# Altium project eps.PrjPCB (part 2 of 2)

## Sheet boost.SchDoc: Boost
size A; DrawnBy: J. Reimer T. Yeung M. Hirole; Organization: UTAT SS; DocumentNumber: 3; Revision: 2.0; SheetNumber: 3; SheetTotal: 17
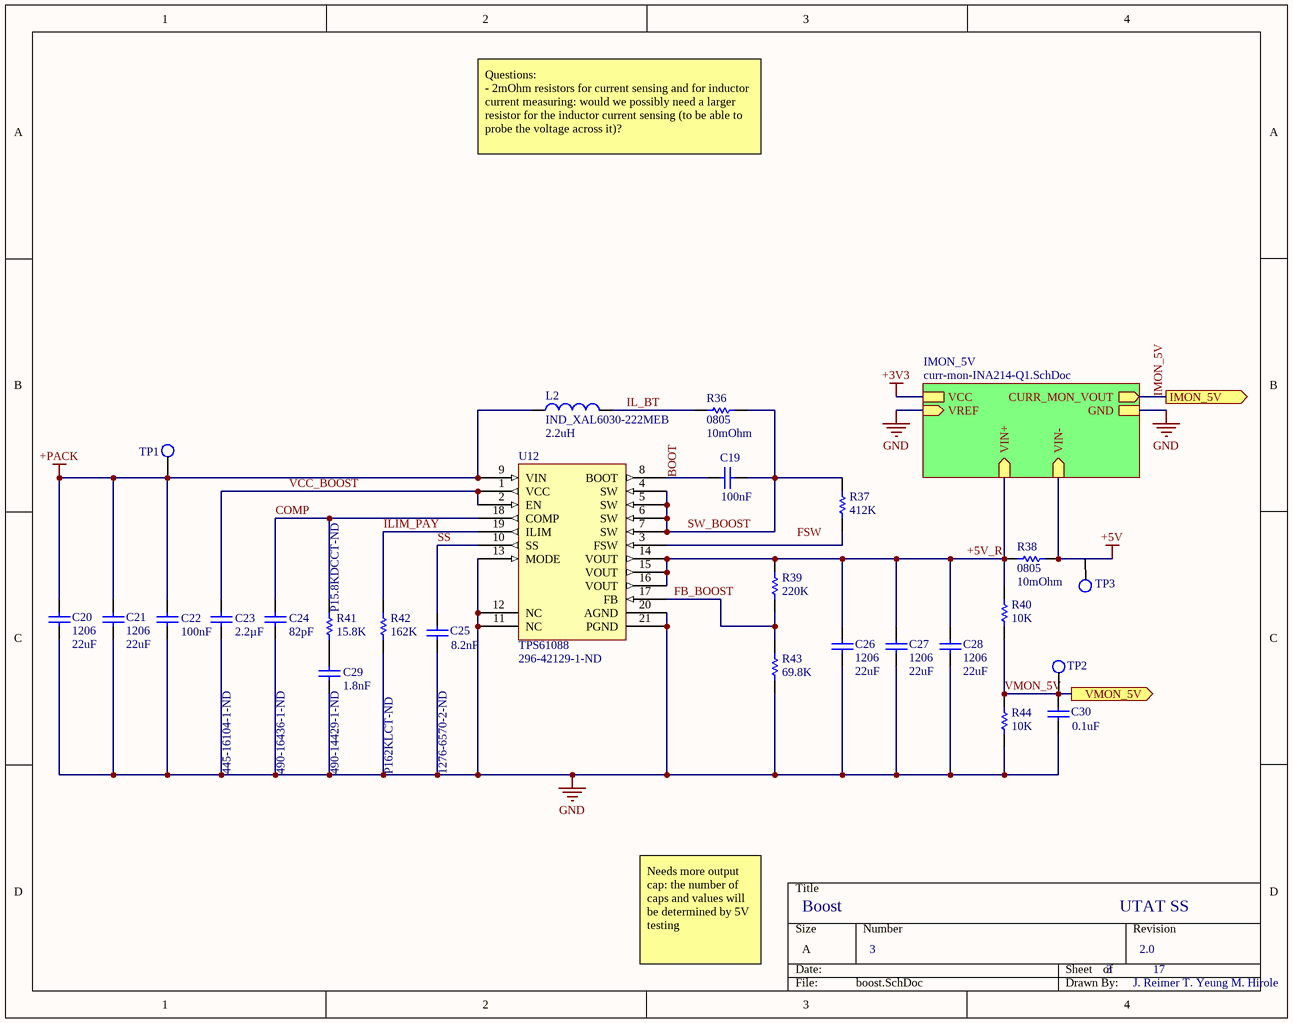
[diagram p9: boost.SchDoc]

### Parts
C19  value 100nF  [CAP0402R]  (hidden comment: 0402)
C20  1206  value 22uF  [CAP1206R]
C21  1206  value 22uF  [CAP1206R]
C22  value 100nF  [CAP0402R]  (hidden comment: 0402)
C23  value 2.2µF  Supplier Part Number 1: 445-16104-1-ND  [CAP0603R]  (hidden comment: 0603)
C24  value 82pF  Supplier Part Number 1: 490-16436-1-ND  [CAP0402R]  (hidden comment: 0402)
C25  value 8.2nF  Supplier Part Number 1: 1276-6570-2-ND  [CAP0402R]  (hidden comment: 0402)
C26  1206  value 22uF  [CAP1206R]
C27  1206  value 22uF  [CAP1206R]
C28  1206  value 22uF  [CAP1206R]
C29  value 1.8nF  Supplier Part Number 1: 490-14429-1-ND  [CAP0402R]  (hidden comment: 0402)
C30  value 0.1uF  [CAP0402R]  (hidden comment: 0402)
L2  IND_XAL6030-222MEB  value 2.2uH  [XAL6030-222MEB]
R36  0805  value 10mOhm  [RES0805R]
R37  value 412K  [RES0402R]  (hidden comment: 0402)
R38  0805  value 10mOhm  [RES0805R]
R39  value 220K  [RES0402R]  (hidden comment: 0402)
R40  value 10K  [RES0402R]  (hidden comment: 0402)
R41  value 15.8K  Supplier Part Number 1: P15.8KDCCT-ND  [RES0402R]  (hidden comment: 0402)
R42  value 162K  Supplier Part Number 1: P162KLCT-ND  [RES0402R]  (hidden comment: 0402)
R43  value 69.8K  [RES0402R]  (hidden comment: 0402)
R44  value 10K  [RES0402R]  (hidden comment: 0402)
U12  TPS61088  Supplier Part Number 1: 296-42129-1-ND  [QFN50P450X350X100-21N]

### Sub-sheets
IMON_5V = curr-mon-INA214-Q1.SchDoc (file not in this document): VREF (in), VIN+ (in), VCC, GND, VIN- (in), CURR_MON_VOUT (out)

### Ports
IMON_5V (out), VMON_5V (out)

### Nets
+5V: R38.2 ; sheet IMON_5V/VIN-
+PACK: C20.2 C21.2 C22.2 L2.1 U12.9(VIN)
GND: C20.1 C21.1 C22.1 C23.1 C24.1 C25.1 C26.1 C27.1 C28.1 C29.1 C30.2 R42.1 R43.1 R44.1 U12.11(NC) U12.12(NC) U12.13(MODE) U12.20(AGND) U12.21(PGND) ; sheet IMON_5V/VREF, sheet IMON_5V/GND
+5V_R: C26.2 C27.2 C28.2 R38.1 R39.2 R40.2 U12.14(VOUT) U12.15(VOUT) U12.16(VOUT) ; sheet IMON_5V/VIN+
BOOT: C19.2 U12.8(BOOT)
COMP: C24.2 R41.2 U12.18(COMP)
FB_BOOST: R39.1 R43.2 U12.17(FB)
IL_BT: L2.2 R36.1
ILIM_PAY: R42.2 U12.19(ILIM)
IMON_5V: port IMON_5V, sheet IMON_5V/CURR_MON_VOUT
SS: C25.2 U12.10(SS)
SW_BOOST: C19.1 R36.2 R37.1 U12.4(SW) U12.5(SW) U12.6(SW) U12.7(SW)
VCC_BOOST: C23.2 U12.1(VCC) U12.2(EN)
VMON_5V: C30.1 R40.1 R44.2 ; port VMON_5V
NetC29_2: C29.2 R41.1
NetR37_2: R37.2 U12.3(FSW)

### Notes on the sheet
- Questions:
  - 2mOhm resistors for current sensing and for inductor current measuring: would we possibly need a larger resistor for the inductor current sensing (to be able to probe the voltage across it)?
- TP1
- (near R38) TP3
- (near C30) TP2
- Needs more output cap: the number of caps and values will be determined by 5V testing
- Labels drawn without touching a wire or pin: FSW

### Library data of the parts
C19 C22 C30 = CAP0402: 0402 capacitor
C20 C21 C26-C28 = CAP1206: 1206 capacitor
C23 = CAP0603: 0603 capacitor; Manufacturer: TDK; Manufacturer Part Number: CGA3E1X7S1C225K080AC; Capacitance: 2.2uF; Tolerance: 10%; Voltage Rating: 16V; Dielectric: X7S; Supplier 1: Digi-Key; Stock 1: 772454; Pricing 1: 1=0.3, 10=0.203, 100=0.115, 500=0.08114, 1000=0.071 (USD); Mount: Surface Mount; Case/Package: 0603; Case Code (Metric): 1608; Case Code (Imperial): 0603; Min Operating Temperature: -55°C; Max Operating Temperature: 125°C; Package Quantity: 1; Packaging: Cut Tape; Voltage Rating (DC): 16V; Length: 0.063inch; Width: 0.031inch; Thickness: 0.035inch; Ratings: AEC-Q200; REACH SVHC: No SVHC; Lead Free: Lead Free; ComponentLink1URL: https://product.tdk.com/info/en/catalog/spec/mlccspec_automotive_general_midvoltage_en.pdf?src-supplier=Digi-Key; ComponentLink1Description: https://product.tdk.com/info/en/catalog/spec/mlccspec_automotive_general_midvoltage_en.pdf?src-supplier=Digi-Key; ComponentLink2URL: http://www.farnell.com/datasheets/1936565.pdf?src-supplier=Element14; ComponentLink2Description: http://www.farnell.com/datasheets/1936565.pdf?src-supplier=Element14; ComponentLink3URL: https://product.tdk.com/info/en/catalog/datasheets/mlcc_automotive_general_en.pdf?src-supplier=Digi-Key; ComponentLink3Description: https://product.tdk.com/info/en/catalog/datasheets/mlcc_automotive_general_en.pdf?src-supplier=Digi-Key; ComponentLink4URL: http://product.tdk.com/en/catalog/datasheets/mlcc_automotive_general_en.pdf?src-supplier=Avnet; ComponentLink4Description: http://product.tdk.com/en/catalog/datasheets/mlcc_automotive_general_en.pdf?src-supplier=Avnet; ComponentLink5URL: http://www.farnell.com/datasheets/2292075.pdf?src-supplier=Farnell; ComponentLink5Description: http://www.farnell.com/datasheets/2292075.pdf?src-supplier=Farnell; ComponentLink6URL: http://www.farnell.com/datasheets/1936565.pdf?src-supplier=Farnell; ComponentLink6Description: http://www.farnell.com/datasheets/1936565.pdf?src-supplier=Farnell
C24 = CAP0402: 0402 capacitor; Manufacturer: Murata; Manufacturer Part Number: GCM1555C1H820FA16D; Tolerance: 1%; Voltage Rating: 50V; Supplier 1: Digi-Key; Stock 1: 58762; Pricing 1: 1=0.13, 10=0.09, 100=0.0424, 500=0.0297, 1000=0.02459, 2500=0.02289, 5000=0.02094 (USD); Mount: Surface Mount; Case/Package: 0402; Case Code (Imperial): 0402; Case Code (Metric): 1005; Min Operating Temperature: -55°C; Max Operating Temperature: 125°C; Packaging: Tape and Reel; Capacitance: 82pF; Ratings: AEC-Q200; ComponentLink1URL: http://search.murata.co.jp/Ceramy/image/img/A01X/G101/ENG/GCM1555C1H820FA16-01.pdf?src-supplier=Digi-Key; ComponentLink1Description: http://search.murata.co.jp/Ceramy/image/img/A01X/G101/ENG/GCM1555C1H820FA16-01.pdf?src-supplier=Digi-Key
C25 = CAP0402: 0402 capacitor; Manufacturer: Samsung; Manufacturer Part Number: CL05B822KB5VPNC; Voltage Rating: 50V; Tolerance: 10%; Supplier 1: Digi-Key; Stock 1: 10000; Pricing 1: 10000=0.00495 (USD); Mount: Surface Mount; Case/Package: 0402; Case Code (Metric): 1005; Case Code (Imperial): 0402; Min Operating Temperature: -55°C; Max Operating Temperature: 125°C; Packaging: Tape and Reel; Capacitance: 8.2nF; Features: Soft Termination; Length: 0.039inch; Width: 0.02inch; Thickness: 0.022inch; Ratings: AEC-Q200
C29 = CAP0402: 0402 capacitor; Manufacturer: Murata; Manufacturer Part Number: GCM155R71H182KA37D; Tolerance: 10%; Voltage Rating: 50V; Supplier 1: Digi-Key; Stock 1: 73085; Pricing 1: 1=0.1, 10=0.032, 100=0.0143, 500=0.01022, 1000=0.00803, 2500=0.0073, 5000=0.00671 (USD); Mount: Surface Mount; Case/Package: 0402; Case Code (Imperial): 0402; Case Code (Metric): 1005; Min Operating Temperature: -55°C; Max Operating Temperature: 125°C; Packaging: Cut Tape; Capacitance: 1.8nF; Ratings: AEC-Q200; ComponentLink1URL: http://search.murata.co.jp/Ceramy/image/img/A01X/partnumbering_e_02.pdf?src-supplier=Digi-Key; ComponentLink1Description: http://search.murata.co.jp/Ceramy/image/img/A01X/partnumbering_e_02.pdf?src-supplier=Digi-Key; ComponentLink2URL: http://search.murata.co.jp/Ceramy/image/img/A01X/G101/ENG/GCM155R71H182KA37-01.pdf?src-supplier=Digi-Key; ComponentLink2Description: http://search.murata.co.jp/Ceramy/image/img/A01X/G101/ENG/GCM155R71H182KA37-01.pdf?src-supplier=Digi-Key
L2 = IND_XAL6030-222MEB: Inductor; Manufacturer: Coilcraft; Code_IEC: 1005; Core Material: Composite; Tolerance: 20%; Self Resonant Frequency: 30MHz; Shielding: Shielded; Max DC Current: 10A; DC Resistance (DCR): 13.97mR; Test Frequency: 100kHz; Published: 8-Jun-2000; LatestRevisionDate: 29-May-2009; LatestRevisionNote: IPC-7351 Footprint Added.; PackageReference: 0402-A; Publisher: Altium Limited; PackageDescription: Chip Inductor; Code_JEITA: 0402; ComponentLink1Description: Supplier Link; ComponentLink1URL: https://www.mouser.ca/ProductDetail/Coilcraft/XAL6030-222MEB?qs=sGAEpiMZZMsg%252By3WlYCkU2kWFds1hA9DXj9xdKzQVV4%3D; Supplier 1: Mouser; Manufacturer Part Number: XAL6030-222MEB; Stock 1: 3253; Pricing 1: 1=1.85, 10=1.85, 50=1.85, 100=1.7, 400=1.28, 800=0.942, 1000=0.942, 2000=0.877, 10000=0.877 (USD); Min Operating Temperature: -40°C; Max Operating Temperature: 125°C; Packaging: Tape and Reel; Package Quantity: 20; Inductance: 2.2uH; Termination: SMD/SMT; Length: 6.76mm; Height: 3.1mm; Width: 6.56mm; Lead Free: Contains Lead; Supplier Part Number 1: 994-XAL6030-222MEB
R36 R38 = RES0805: 0805 resistor; Manufacturer: Panasonic; Manufacturer Part Number: ERJ-8BWJR010V; Resistance: 10mR; Power Rating: 1W; Tolerance: 5%; Temperature Coefficient: 200ppm/°C; Supplier 1: Digi-Key; Supplier Part Number 1: P.010AVDKR-ND; Stock 1: 70650; Pricing 1: 1=0.68, 10=0.5, 100=0.2911, 1000=0.16327, 2500=0.15763 (USD); Mount: Surface Mount; Case/Package: 1206; Case Code (Imperial): 1206; Case Code (Metric): 3216; Contact Plating: Tin; Min Operating Temperature: -55°C; Max Operating Temperature: 155°C; Packaging: Tape and Reel; Package Quantity: 1; Termination: SMD/SMT; Composition: Thick Film; Number of Terminations: 2; Military Standard: Not; Max Power Dissipation: 1W; Features: Automotive AEC-Q200; Length: 3.2mm; Height: 0.65mm; Width: 1.6mm; Depth: 1.6mm; Radiation Hardening: No; Lead Free: Lead Free; ComponentLink1URL: http://industrial.panasonic.com/www-data/pdf/AOA0000/AOA0000CE3.pdf?src-supplier=Avnet; ComponentLink1Description: http://industrial.panasonic.com/www-data/pdf/AOA0000/AOA0000CE3.pdf?src-supplier=Avnet; ComponentLink2URL: https://industrial.panasonic.com/cdbs/www-data/pdf/RDN0000/AOA0000C313.pdf?src-supplier=Digi-Key; ComponentLink2Description: https://industrial.panasonic.com/cdbs/www-data/pdf/RDN0000/AOA0000C313.pdf?src-supplier=Digi-Key; ComponentLink3URL: http://uk.rs-online.com/webdocs/13b8/0900766b813b869e.pdf?src-supplier=RSComponents; ComponentLink3Description: http://uk.rs-online.com/webdocs/13b8/0900766b813b869e.pdf?src-supplier=RSComponents
R37 R39 R40 R43 R44 = RES0402: 0402 resistor
R41 = RES0402: 0402 resistor; Manufacturer: Panasonic; Manufacturer Part Number: ERA-2AEB1582X; Resistance: 15.8kR; Power Rating: 63mW; Tolerance: 0.1%; Voltage Rating: 25V; Temperature Coefficient: 25ppm/°C; Voltage Rating (DC): 50V; Supplier 1: Digi-Key; Stock 1: 20576; Pricing 1: 1=0.45, 10=0.321, 100=0.1283, 1000=0.06322, 2500=0.05858, 5000=0.053 (USD); Mount: Surface Mount; Case/Package: 0402; Case Code (Metric): 1005; Case Code (Imperial): 0402; Contact Plating: Tin; Min Operating Temperature: -55°C; Max Operating Temperature: 155°C; Packaging: Tape and Reel; Package Quantity: 10000; Composition: Thin Film,Metal Film; Number of Terminations: 2; Max Power Dissipation: 63mW; Termination: SMD/SMT; Length: 0.039inch; Height: 0.016inch; Width: 0.02inch; Radiation Hardening: No; REACH SVHC: Unknown; Lead Free: Lead Free; ComponentLink1URL: http://industrial.panasonic.com/www-data/pdf/AOA0000/AOA0000CE26.pdf?src-supplier=Avnet; ComponentLink1Description: http://industrial.panasonic.com/www-data/pdf/AOA0000/AOA0000CE26.pdf?src-supplier=Avnet
R42 = RES0402: 0402 resistor; Manufacturer: Panasonic; Manufacturer Part Number: ERJ-2RKF1623X; Resistance: 162kR; Power Rating: 100mW; Tolerance: 1%; Voltage Rating: 50V; Temperature Coefficient: 100ppm/°C; Supplier 1: Digi-Key; Stock 1: 0; Mount: Surface Mount; Case/Package: 0402; Weight: 2.8E-05oz; Case Code (Imperial): 0402; Case Code (Metric): 1005; Contact Plating: Tin; Min Operating Temperature: -55°C; Max Operating Temperature: 155°C; Packaging: Tape and Reel; Package Quantity: 10000; Composition: Thick Film; Termination: SMD/SMT; Number of Terminations: 2; Military Standard: Not; Max Power Dissipation: 100mW; Voltage Rating (DC): 50V; Features: Automotive AEC-Q200; Length: 1mm; Height: 0.35mm; Width: 0.5mm; Depth: 0.5mm; Radiation Hardening: No; REACH SVHC: Yes; Lead Free: Lead Free; ComponentLink1URL: http://www.farnell.com/datasheets/1678782.pdf?src-supplier=Element14; ComponentLink1Description: http://www.farnell.com/datasheets/1678782.pdf?src-supplier=Element14; ComponentLink2URL: http://www.farnell.com/datasheets/1678782.pdf?src-supplier=Farnell; ComponentLink2Description: http://www.farnell.com/datasheets/1678782.pdf?src-supplier=Farnell; ComponentLink3URL: https://www.alliedelec.com/m/d/623f45ff1957d936ff56d46fd1c28cac.pdf?src-supplier=Allied+Electronics; ComponentLink3Description: https://www.alliedelec.com/m/d/623f45ff1957d936ff56d46fd1c28cac.pdf?src-supplier=Allied+Electronics; ComponentLink4URL: http://www.farnell.com/datasheets/1911175.pdf?src-supplier=Farnell; ComponentLink4Description: http://www.farnell.com/datasheets/1911175.pdf?src-supplier=Farnell; ComponentLink5URL: http://www.farnell.com/datasheets/1694929.pdf?src-supplier=Element14; ComponentLink5Description: http://www.farnell.com/datasheets/1694929.pdf?src-supplier=Element14
U12 = TPS61088: Boost converter; Supplier 1: Digi-Key

## Sheet buck_boost.SchDoc: Buck-Boost
size A4; DrawnBy: J. Reimer T. Yeung M. Au; Organization: UTAT SS; DocumentNumber: 5; Revision: 2.0; SheetNumber: 5; SheetTotal: 17
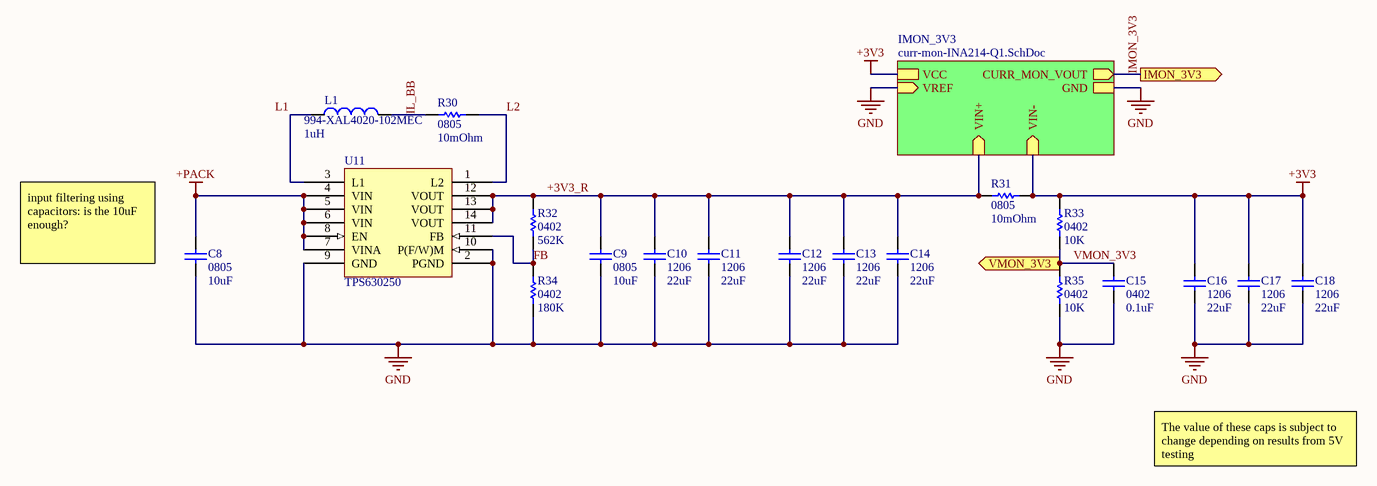
[diagram p10: buck_boost.SchDoc]

### Parts
C8  0805  value 10uF  [CAP0805R]
C9  0805  value 10uF  [CAP0805R]
C10  1206  value 22uF  [CAP1206R]
C11  1206  value 22uF  [CAP1206R]
C12  1206  value 22uF  [CAP1206R]
C13  1206  value 22uF  [CAP1206R]
C14  1206  value 22uF  [CAP1206R]
C15  0402  value 0.1uF  [CAP0402R]
C16  1206  value 22uF  [CAP1206R]
C17  1206  value 22uF  [CAP1206R]
C18  1206  value 22uF  [CAP1206R]
L1  Inductance: 1uH  Supplier Part Number 1: 994-XAL4020-102MEC  [XAL4020-102ME]  (hidden comment: IND_XAL4020-102ME)
R30  0805  value 10mOhm  [RES0805R]
R31  0805  value 10mOhm  [RES0805R]
R32  0402  value 562K  [RES0402R]
R33  0402  value 10K  [RES0402R]
R34  0402  value 180K  [RES0402R]
R35  0402  value 10K  [RES0402R]
U11  TPS630250  [RNC0014A]

### Sub-sheets
IMON_3V3 = curr-mon-INA214-Q1.SchDoc (file not in this document): VREF (in), VIN+ (in), VCC, GND, VIN- (in), CURR_MON_VOUT (out)

### Ports
IMON_3V3 (out), VMON_3V3 (out)

### Nets
+3V3: C16.2 C17.2 C18.2 R31.2 R33.2 ; sheet IMON_3V3/VCC, sheet IMON_3V3/VIN-
+PACK: C8.2 U11.4(VIN) U11.5(VIN) U11.6(VIN) U11.7(VINA) U11.8(EN)
GND: C8.1 C9.1 C10.1 C11.1 C12.1 C13.1 C14.1 C15.1 C16.1 C17.1 C18.1 R34.1 R35.1 U11.2(PGND) U11.9(GND) U11.10(P(F/W)M) ; sheet IMON_3V3/VREF, sheet IMON_3V3/GND
+3V3_R: C9.2 C10.2 C11.2 C12.2 C13.2 C14.2 R31.1 R32.2 U11.12(VOUT) U11.13(VOUT) U11.14(VOUT) ; sheet IMON_3V3/VIN+
FB: R32.1 R34.2 U11.11(FB)
IL_BB: L1.2 R30.1
IMON_3V3: port IMON_3V3, sheet IMON_3V3/CURR_MON_VOUT
L1: L1.1 U11.3(L1)
L2: R30.2 U11.1(L2)
VMON_3V3: C15.2 R33.1 R35.2 ; port VMON_3V3

### Notes on the sheet
- (near C8) input filtering using capacitors: is the 10uF enough?
- The value of these caps is subject to change depending on results from 5V testing

### Library data of the parts
C8 C9 = CAP0805: 0805 capacitor
C10-C14 C16-C18 = CAP1206: 1206 capacitor
C15 = CAP0402: 0402 capacitor
L1 = IND_XAL4020-102ME: 1uH 20% 9.6A 14.60mOhms AEC-Q200; Manufacturer: Coilcraft; Manufacturer Part Number: XAL4020-102MEC; Core Material: Composite; Self Resonant Frequency: 79MHz; Shielding: Shielded; DC Resistance (DCR): 14.6mR; Test Frequency: 100kHz; Supplier 1: Mouser; Stock 1: 13905; Pricing 1: 1=1.8, 10=1.8, 50=1.8, 100=1.44, 500=0.944, 1000=0.869, 2000=0.809, 10000=0.809 (USD); Min Operating Temperature: -40°C; Max Operating Temperature: 125°C; Packaging: Tape and Reel; Package Quantity: 1000; Tolerance: 20%; Max DC Current: 9.6A; Termination: SMD/SMT; Length: 4.3mm; Height: 2.1mm; Width: 4.3mm; Lead Free: Contains Lead
R30 R31 = RES0805: as R36 on sheet boost; Supplier 1: Digi-Key; Supplier Part Number 1: P.010AVDKR-ND; Stock 1: 70650; Pricing 1: 1=0.68, 10=0.5, 100=0.2911, 1000=0.16327, 2500=0.15763 (USD); Mount: Surface Mount; Case/Package: 1206; Case Code (Imperial): 1206; Case Code (Metric): 3216; Contact Plating: Tin; Min Operating Temperature: -55°C; Max Operating Temperature: 155°C; Packaging: Tape and Reel; Package Quantity: 1; Termination: SMD/SMT; Composition: Thick Film; Number of Terminations: 2; Military Standard: Not; Max Power Dissipation: 1W; Features: Automotive AEC-Q200; Length: 3.2mm; Height: 0.65mm; Width: 1.6mm; Depth: 1.6mm; Radiation Hardening: No; Lead Free: Lead Free; ComponentLink1URL: http://industrial.panasonic.com/www-data/pdf/AOA0000/AOA0000CE3.pdf?src-supplier=Avnet; ComponentLink1Description: http://industrial.panasonic.com/www-data/pdf/AOA0000/AOA0000CE3.pdf?src-supplier=Avnet; ComponentLink2URL: https://industrial.panasonic.com/cdbs/www-data/pdf/RDN0000/AOA0000C313.pdf?src-supplier=Digi-Key; ComponentLink2Description: https://industrial.panasonic.com/cdbs/www-data/pdf/RDN0000/AOA0000C313.pdf?src-supplier=Digi-Key; ComponentLink3URL: http://uk.rs-online.com/webdocs/13b8/0900766b813b869e.pdf?src-supplier=RSComponents; ComponentLink3Description: http://uk.rs-online.com/webdocs/13b8/0900766b813b869e.pdf?src-supplier=RSComponents
R32-R35 = RES0402: 0402 resistor
U11 = TPS630250: Buck-boost converter; Supplier 1: Digi-Key; Supplier Part Number 1: 296-42036-6-ND

## Sheet solar.SchDoc: Photovoltaics
size A4; DrawnBy: J. Reimer T. Yeung M. Au; Organization: UTAT SS; DocumentNumber: 6; Revision: 2.0; SheetNumber: 6; SheetTotal: 17
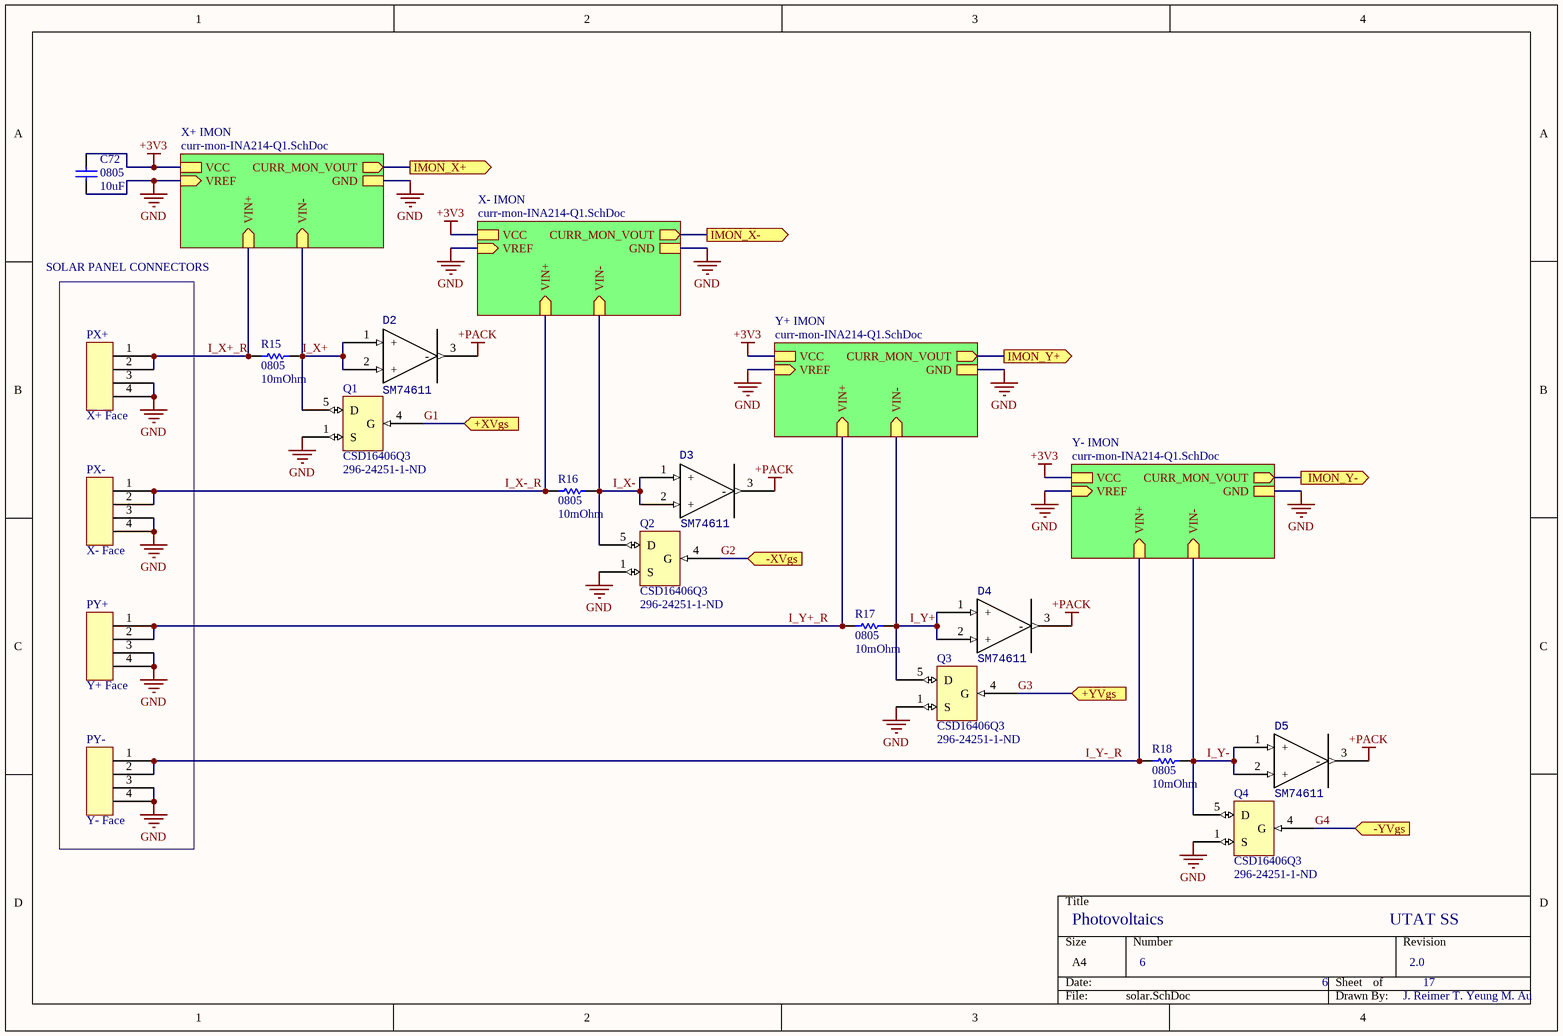
[diagram p11: solar.SchDoc]

### Parts
C72  0805  value 10uF  [CAP0805R]
D2  SM74611  [TO254P1435X464-3N]
D3  SM74611  [TO254P1435X464-3N]
D4  SM74611  [TO254P1435X464-3N]
D5  SM74611  [TO254P1435X464-3N]
PX+  DF13A-4P-1.25H(51)  [DF13A-4P-1.25H(51)]  (value not drawn)
PX-  DF13A-4P-1.25H(51)  [DF13A-4P-1.25H(51)]  (value not drawn)
PY+  DF13A-4P-1.25H(51)  [DF13A-4P-1.25H(51)]  (value not drawn)
PY-  DF13A-4P-1.25H(51)  [DF13A-4P-1.25H(51)]  (value not drawn)
Q1  CSD16406Q3  Supplier Part Number 1: 296-24251-1-ND  [CSD16406Q3]
Q2  CSD16406Q3  Supplier Part Number 1: 296-24251-1-ND  [CSD16406Q3]
Q3  CSD16406Q3  Supplier Part Number 1: 296-24251-1-ND  [CSD16406Q3]
Q4  CSD16406Q3  Supplier Part Number 1: 296-24251-1-ND  [CSD16406Q3]
R15  0805  value 10mOhm  [RES0805R]
R16  0805  value 10mOhm  [RES0805R]
R17  0805  value 10mOhm  [RES0805R]
R18  0805  value 10mOhm  [RES0805R]

### Sub-sheets
X+ IMON = curr-mon-INA214-Q1.SchDoc (file not in this document): VREF (in), VIN+ (in), VCC, GND, VIN- (in), CURR_MON_VOUT (out)
X- IMON = curr-mon-INA214-Q1.SchDoc (file not in this document): VREF (in), VIN+ (in), VCC, GND, VIN- (in), CURR_MON_VOUT (out)
Y+ IMON = curr-mon-INA214-Q1.SchDoc (file not in this document): VREF (in), VIN+ (in), VCC, GND, VIN- (in), CURR_MON_VOUT (out)
Y- IMON = curr-mon-INA214-Q1.SchDoc (file not in this document): VREF (in), VIN+ (in), VCC, GND, VIN- (in), CURR_MON_VOUT (out)

### Ports
+XVgs (in), +YVgs (in), -XVgs (in), -YVgs (in), IMON_X+ (out), IMON_X- (out), IMON_Y+ (out), IMON_Y- (out)

### Nets
+3V3: C72.2 ; sheet Y- IMON/VCC, sheet Y+ IMON/VCC, sheet X- IMON/VCC, sheet X+ IMON/VCC
+PACK: D2.3(-) D3.3(-) D4.3(-) D5.3(-)
GND: C72.1 PX+.3 PX+.4 PX-.3 PX-.4 PY+.3 PY+.4 PY-.3 PY-.4 Q1.1(S) Q2.1(S) Q3.1(S) Q4.1(S) ; sheet Y- IMON/VREF, sheet Y- IMON/GND, sheet Y+ IMON/VREF, sheet Y+ IMON/GND, sheet X- IMON/VREF, sheet X- IMON/GND, sheet X+ IMON/VREF, sheet X+ IMON/GND
G1: Q1.4(G) ; port +XVgs
G2: Q2.4(G) ; port -XVgs
G3: Q3.4(G) ; port +YVgs
G4: Q4.4(G) ; port -YVgs
I_X+: D2.1(+) D2.2(+) Q1.5(D) R15.2 ; sheet X+ IMON/VIN-
I_X+_R: PX+.1 PX+.2 R15.1 ; sheet X+ IMON/VIN+
I_X-: D3.1(+) D3.2(+) Q2.5(D) R16.2 ; sheet X- IMON/VIN-
I_X-_R: PX-.1 PX-.2 R16.1 ; sheet X- IMON/VIN+
I_Y+: D4.1(+) D4.2(+) Q3.5(D) R17.2 ; sheet Y+ IMON/VIN-
I_Y+_R: PY+.1 PY+.2 R17.1 ; sheet Y+ IMON/VIN+
I_Y-: D5.1(+) D5.2(+) Q4.5(D) R18.2 ; sheet Y- IMON/VIN-
I_Y-_R: PY-.1 PY-.2 R18.1 ; sheet Y- IMON/VIN+
(unnamed): port IMON_X+, sheet X+ IMON/CURR_MON_VOUT
(unnamed): port IMON_X-, sheet X- IMON/CURR_MON_VOUT
(unnamed): port IMON_Y+, sheet Y+ IMON/CURR_MON_VOUT
(unnamed): port IMON_Y-, sheet Y- IMON/CURR_MON_VOUT

### Notes on the sheet
- SOLAR PANEL CONNECTORS
- (near PX+) X+ Face
- (near PX-) X- Face
- (near PY+) Y+ Face
- (near PY-) Y- Face

### Library data of the parts
C72 = CAP0805: 0805 capacitor
D2-D5 = SM74611: PV Diode; Manufacturer: Texas Instruments; Manufacturer Part Number: SM74611KTTR; Forward Current: 15A; Peak Reverse Current: 300nA; Max Repetitive Reverse Voltage (Vrrm): 28V; Element Configuration: Single; Number of Outputs: 1; Operating Supply Current: 0pA; Max Supply Voltage: 30V; Min Supply Voltage: 100mV; Max Power Dissipation: 575mW; Supplier 1: Digi-Key; Stock 1: 19774; Pricing 1: 1=3.6, 10=3.236, 100=2.6512 (USD); Mount: Surface Mount; Case/Package: TO-263-3; Number of Pins: 3; Weight: 0.068654oz; Min Operating Temperature: -40°C; Max Operating Temperature: 125°C; Package Quantity: 1; Packaging: Tape and Reel; Output Current: 15A; Average Rectified Current: 15A; Number of Drivers: 1; Quiescent Current: 0pA; Max Reverse Voltage (DC): 30V; Radiation Hardening: No; Lead Free: Contains Lead; REACH SVHC: No SVHC; ComponentLink1URL: http://www.ti.com/lit/ml/mpsf052b/mpsf052b.pdf?keyMatch=ktt%20package%20drawing&tisearch=Search-EN-Everything&src-supplier=Digi-Key; ComponentLink1Description: http://www.ti.com/lit/ml/mpsf052b/mpsf052b.pdf?keyMatch=ktt%20package%20drawing&tisearch=Search-EN-Everything&src-supplier=Digi-Key; Supplier Part Number 1: 296-35688-6-ND
PX+ PX- PY+ PY- = DF13A-4P-1.25H(51): 4 pos DF13 right angle surface mount connector; Supplier 1: Digi-Key; Supplier Part Number 1: H125779CT-ND
Q1-Q4 = CSD16406Q3: Power MOSFET; Manufacturer: Texas Instruments; Rise Time: 12.9ns; Rds On Max: 5.3mR; Input Capacitance: 1.1nF; Nominal Vgs: 1.7V; Dual Supply Voltage: 25V; Continuous Drain Current (ID): 60A; Max Power Dissipation: 2.7W; Fall Time: 4.8ns; Turn-Off Delay Time: 8.5ns; Gate to Source Voltage (Vgs): 16V; Turn-On Delay Time: 7.3ns; Number of Elements: 1; Element Configuration: Single; Supplier 1: Digi-Key; Manufacturer Part Number: CSD16406Q3; Stock 1: 16574; Pricing 1: 1=1.1, 10=0.981, 100=0.7652, 500=0.63212, 1000=0.49904 (USD); Mount: Surface Mount; Case/Package: QFN; Number of Pins: 8; Contact Plating: Tin,Matte; Min Operating Temperature: -55°C; Max Operating Temperature: 150°C; Packaging: Tape and Reel; Package Quantity: 1; Drain to Source Voltage (Vdss): 25V; Drain to Source Breakdown Voltage: 25V; Power Dissipation: 2.7W; Termination: SMD/SMT; Threshold Voltage: 1.7V; Radiation Hardening: No; REACH SVHC: No SVHC; Lead Free: Contains Lead; ComponentLink1URL: http://www.ti.com/general/docs/lit/getliterature.tsp?genericPartNumber=CSD16406Q3&&fileType=pdf&src-supplier=Avnet; ComponentLink1Description: http://www.ti.com/general/docs/lit/getliterature.tsp?genericPartNumber=CSD16406Q3&&fileType=pdf&src-supplier=Avnet; ComponentLink2URL: http://www.ti.com/lit/ds/symlink/csd16406q3.pdf?src-supplier=Digi-Key; ComponentLink2Description: http://www.ti.com/lit/ds/symlink/csd16406q3.pdf?src-supplier=Digi-Key; ComponentLink3URL: http://www.mouser.com/ds/2/405/slps202a-128073.pdf?src-supplier=Mouser; ComponentLink3Description: http://www.mouser.com/ds/2/405/slps202a-128073.pdf?src-supplier=Mouser; ComponentLink4URL: http://www.farnell.com/datasheets/483980.pdf?src-supplier=Farnell; ComponentLink4Description: http://www.farnell.com/datasheets/483980.pdf?src-supplier=Farnell; ComponentLink5URL: http://www.ti.com/general/docs/lit/getliterature.tsp?genericPartNumber=CSD16406Q3&amp;&amp;fileType=pdf&src-supplier=Farnell; ComponentLink5Description: http://www.ti.com/general/docs/lit/getliterature.tsp?genericPartNumber=CSD16406Q3&amp;&amp;fileType=pdf&src-supplier=Farnell; ComponentLink6URL: http://www.farnell.com/simulation/1744921.zip?src-supplier=Element14; ComponentLink6Description: http://www.farnell.com/simulation/1744921.zip?src-supplier=Element14
R15-R18 = RES0805: as R36 on sheet boost; Supplier 1: Digi-Key; Supplier Part Number 1: P.010AVDKR-ND; Stock 1: 70650; Pricing 1: 1=0.68, 10=0.5, 100=0.2911, 1000=0.16327, 2500=0.15763 (USD); Mount: Surface Mount; Case/Package: 1206; Case Code (Imperial): 1206; Case Code (Metric): 3216; Contact Plating: Tin; Min Operating Temperature: -55°C; Max Operating Temperature: 155°C; Packaging: Tape and Reel; Package Quantity: 1; Termination: SMD/SMT; Composition: Thick Film; Number of Terminations: 2; Military Standard: Not; Max Power Dissipation: 1W; Features: Automotive AEC-Q200; Length: 3.2mm; Height: 0.65mm; Width: 1.6mm; Depth: 1.6mm; Radiation Hardening: No; Lead Free: Lead Free; ComponentLink1URL: http://industrial.panasonic.com/www-data/pdf/AOA0000/AOA0000CE3.pdf?src-supplier=Avnet; ComponentLink1Description: http://industrial.panasonic.com/www-data/pdf/AOA0000/AOA0000CE3.pdf?src-supplier=Avnet; ComponentLink2URL: https://industrial.panasonic.com/cdbs/www-data/pdf/RDN0000/AOA0000C313.pdf?src-supplier=Digi-Key; ComponentLink2Description: https://industrial.panasonic.com/cdbs/www-data/pdf/RDN0000/AOA0000C313.pdf?src-supplier=Digi-Key; ComponentLink3URL: http://uk.rs-online.com/webdocs/13b8/0900766b813b869e.pdf?src-supplier=RSComponents; ComponentLink3Description: http://uk.rs-online.com/webdocs/13b8/0900766b813b869e.pdf?src-supplier=RSComponents

## Sheet transceiver.SchDoc
size A4
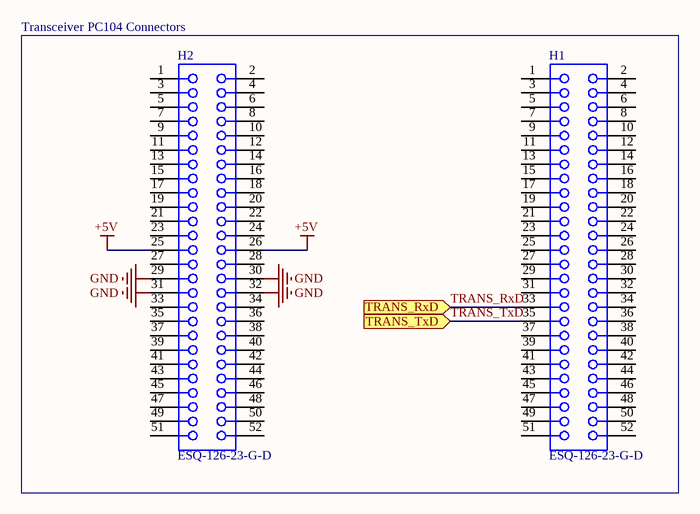
[diagram p12: transceiver.SchDoc]

### Parts
H1  ESQ-126-23-G-D  [SSW-126-01-G-D]
H2  ESQ-126-23-G-D  [SSW-126-01-G-D]

### Blocks framed on the sheet
Transceiver PC104 Connectors: H1 H2

### Ports
TRANS_RxD (in), TRANS_TxD (in)

### Nets
+5V: H2.25 H2.26
GND: H2.29 H2.30 H2.31 H2.32
TRANS_RxD: H1.33 ; port TRANS_RxD
TRANS_TxD: H1.35 ; port TRANS_TxD

Not connected (* = marked no-connect by the designer): H1 1 2 3 4 5 6 7 8 9 10 11 12 13 14 15 16 17 18 19 20 21 22 23 24 25 26 27 28 29 30 31 32 34 36 37 38 39 40 41 42 43 44 45 46 47 48 49 50 51 52; H2 1 2 3 4 5 6 7 8 9 10 11 12 13 14 15 16 17 18 19 20 21 22 23 24 27 28 33 34 35 36 37 38 39 40 41 42 43 44 45 46 47 48 49 50 51 52

### Library data of the parts
H1 H2 = ESQ-126-23-G-D: PC/104(TM) Elevated Socket Strip, Through-hole, Vertical, -55 to 125 degC, 2.54 mm Pitch, 52-Pin, Female, RoHS; Manufacturer: Samtec; Pitch: 2.54 mm; DatasheetVersion: F-214; PackageVersion: BZ, 9/1998; PackageReference: ESQ-126-23-X-D; PackageDescription: ESQ Strip ASM; Supplier 1: Newark; Supplier Part Number 1: 92P1348; Orientation: Vertical; RoHS: True; Temperature Range: -55 to 125 degC; Mounting Technology: Through-hole; PartNumber: ESQ-126-23-G-D; ComponentLink1Description: Manufacturer URL; ComponentLink1URL: http://www.samtec.com; ComponentLink2Description: Datasheet; ComponentLink2URL: http://www.samtec.com/documents/webfiles/pdf/ESQ_TH.PDF; ComponentLink3Description: Package Specification; ComponentLink3URL: http://www.samtec.com/documents/webfiles/cpdf/ESQ-1XX-XX-X-X-XXX-XX-X-XX-MKT.pdf
  H1: Supplier 2: Digi-Key; Supplier Part Number 2: ESQ-126-23-G-D-ND

## Nets that join several sheets
+3V3: main (11 pins), eps_digital (C67.2), eps_imu (9 pins), batt (U7.5 U8.5), buck_boost (5 pins), solar (C72.2)
+5V: main (7 pins), boost (R38.2), transceiver (H2.25 H2.26)
+PACK: main (J1.24), batt (R5.2 R6.2), boost (5 pins), buck_boost (6 pins), solar (D2.3 D3.3 D4.3 D5.3)
+PACK_RAW: batt (J5.2 R8.2), dep-switches (DEP+.1 DEP-.1), MAIN/BATTERY/LOAD SWITCHES/DEP+ (6 pins), MAIN/BATTERY/LOAD SWITCHES/DEP- (C65_DEP-.2 U22_DEP-.3), MAIN/BATTERY/LOAD SWITCHES/PAY LOAD SWITCH (6 pins), MAIN/BATTERY/RBF (C65_RBF.2 U22_RBF.3)
+PAY: main (J4.1 J4.2 J4.3), current-limiter (10 pins)
-PACK_RAW: main (RTC_BATT.2), batt (J5.1 J6.2), MAIN/BATTERY/LOAD SWITCHES/DEP+ (5 pins), MAIN/BATTERY/LOAD SWITCHES/DEP- (7 pins), MAIN/BATTERY/LOAD SWITCHES/PAY LOAD SWITCH (5 pins), MAIN/BATTERY/RBF (5 pins)
GND: main (25 pins), eps_digital (5 pins), heaters-sensors (5 pins), eps_imu (7 pins), batt (10 pins), current-limiter (16 pins), boost (19 pins), buck_boost (16 pins), solar (13 pins), transceiver (H2.29 H2.30 H2.31 H2.32)
+PACK_DEP: batt (L4.1 R3.2), MAIN/BATTERY/LOAD SWITCHES/DEP+ (C63_DEP+.2 U22_DEP+.8)
+PAY_LIM: MAIN/BATTERY/LOAD SWITCHES/PAY LOAD SWITCH (C63_PAY_LOAD_SWITCH.2 U22_PAY_LOAD_SWITCH.8), current-limiter (8 pins)
-PACK_DEP: MAIN/BATTERY/LOAD SWITCHES/DEP- (C64_DEP-.2 U22_DEP-.1 U22_DEP-.2 U22_DEP-.9), MAIN/BATTERY/RBF (C63_RBF.2 U22_RBF.8)
-PACK_RBF: batt (*1.6 C1.1 U6.2), MAIN/BATTERY/RBF (C64_RBF.2 U22_RBF.1 U22_RBF.2 U22_RBF.9)
C_GATE_BUFF: main (J1.16), batt (U8.1 U8.4)
D_GATE: batt (*1.1 U6.1 U7.3), MAIN/BATTERY/LOAD SWITCHES/PAY LOAD SWITCH (R84_PAY_LOAD_SWITCH.2 U22_PAY_LOAD_SWITCH.4)
D_GATE_BUFF: main (J1.17), batt (U7.1 U7.4)
G1: eps_digital (R14.2), solar (Q1.4)
G2: eps_digital (R13.2), solar (Q2.4)
G3: eps_digital (R12.2), solar (Q3.4)
G4: eps_digital (R11.2), solar (Q4.4)
NetJ6_1: batt (J6.1 R8.1), MAIN/BATTERY/RBF (R84_RBF.2 U22_RBF.4)
ON1: dep-switches (DEP+.2), MAIN/BATTERY/LOAD SWITCHES/DEP+ (R84_DEP+.2 U22_DEP+.4)
ON2: dep-switches (DEP-.2), MAIN/BATTERY/LOAD SWITCHES/DEP- (R84_DEP-.2 U22_DEP-.4)
RST_OBC: main (J1.8 J2.3 J4.6), eps_digital (R10.1)
RST_PAY: main (J1.11 J2.7 J4.7), eps_digital (R9.1)
TRANS_RxD: main (U3.1), transceiver (H1.33)
TRANS_TxD: main (U3.5), transceiver (H1.35)